# Altium schematic sheet AD628模块.SchDoc
size A4
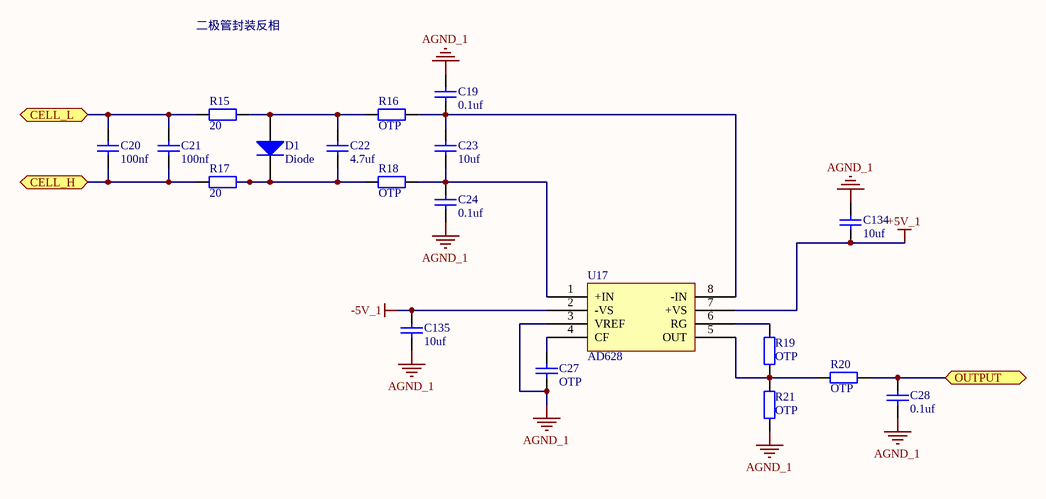
[diagram p0: AD628模块.SchDoc]

## Parts
C19  value 0.1uf  [0805C]  (hidden comment: Cap)
C20  value 100nf  [0805C]  (hidden comment: Cap)
C21  value 100nf  [0805C]  (hidden comment: Cap)
C22  value 4.7uf  [0805C]  (hidden comment: Cap)
C23  value 10uf  [0805C]  (hidden comment: Cap)
C24  value 0.1uf  [0805C]  (hidden comment: Cap)
C27  value OTP  [0805C]  (hidden comment: Cap)
C28  value 0.1uf  [0805C]  (hidden comment: Cap)
C134  value 10uf  [0805C]  (hidden comment: Cap)
C135  value 10uf  [0805C]  (hidden comment: Cap)
D1  Diode  [SMA]
R15  value 20  [0805R]  (hidden comment: Res2)
R16  value OTP  [0805R]  (hidden comment: Res2)
R17  value 20  [0805R]  (hidden comment: Res2)
R18  value OTP  [0805R]  (hidden comment: Res2)
R19  value OTP  [0805R]  (hidden comment: Res2)
R20  value OTP  [0805R]  (hidden comment: Res2)
R21  value OTP  [0805R]  (hidden comment: Res2)
U17  AD628  [MSOP8]

## Ports
CELL_H, CELL_L, OUTPUT

## Nets
+5V_1: C134.2 U17.7(+VS)
-5V_1: C135.2 U17.2(-VS)
AGND_1: C19.2 C24.1 C27.1 C28.1 C134.1 C135.1 R21.1 U17.3(VREF)
CELL_H: C20.1 C21.1 R17.2 ; port CELL_H
CELL_L: C20.2 C21.2 R15.2 ; port CELL_L
OUTPUT: C28.2 R20.1 ; port OUTPUT
NetC19_1: C19.1 C23.2 R16.1 U17.8(-IN)
NetC22_1: C22.1 D1.2(K) R17.1 R18.2
NetC22_2: C22.2 D1.1(A) R15.1 R16.2
NetC23_1: C23.1 C24.2 R18.1 U17.1(+IN)
NetC27_2: C27.2 U17.4(CF)
NetR19_1: R19.1 R20.2 R21.2 U17.5(OUT)
NetR19_2: R19.2 U17.6(RG)

## Notes on the sheet
- 二极管封装反相

## Library data of the parts
C19-C24 C27 C28 C134 C135 = Cap: Capacitor; Published: 8-Jun-2000; LatestRevisionDate: 17-Jul-2002; LatestRevisionNote: Re-released for DXP Platform.; PackageReference: RAD-0.3; Publisher: Altium Limited; PackageDescription: Radial Cap, Thru-Hole; 2 Leads; 0.3 in Pin Spacing
D1 = Diode: Default Diode; Published: 8-Jun-2000; LatestRevisionDate: 17-Jul-2002; LatestRevisionNote: Re-released for DXP Platform.; PackageVersion: Sep-1996; PackageReference: SMC; Publisher: Altium Limited; PackageDescription: DO-214-AB/SMC; 2 C-Bend Leads; Body 7.9 x 5.9 mm, inc. leads (LxW); Code_JEDEC: DO-214-AB
R15-R21 = Res2: Resistor; Published: 8-Jun-2000; LatestRevisionDate: 17-Jul-2002; LatestRevisionNote: Re-released for DXP Platform.; PackageReference: AXIAL-0.4; Publisher: Altium Limited; PackageDescription: Axial Device, Thru-Hole; 2 Leads; 0.4 in Pin Spacing